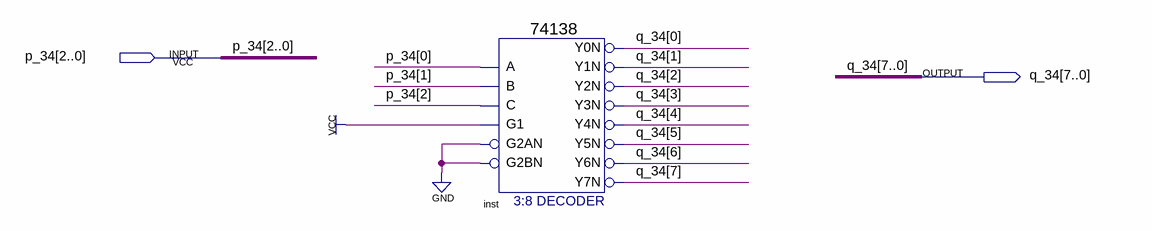
[diagram p0: schematic sheet]
// Quartus schematic dig_select_34.bdf as structural Verilog: 1 symbols, 2 pins
module dig_select_34 (
  input  [2:0] p_34,
  output [7:0] q_34
);

  \74138  inst (
    .A(p_34[0]), .B(p_34[1]), .G1(1'b1), .C(p_34[2]), .G2AN(1'b0), .G2BN(1'b0), .Y0N(q_34[0]), .Y1N(q_34[1]),
    .Y2N(q_34[2]), .Y3N(q_34[3]), .Y4N(q_34[4]), .Y5N(q_34[5]), .Y6N(q_34[6]), .Y7N(q_34[7]));
endmodule
